# Altium schematic sheet ESP32.SchDoc
size A4; SheetNumber: 1; SheetTotal: 3
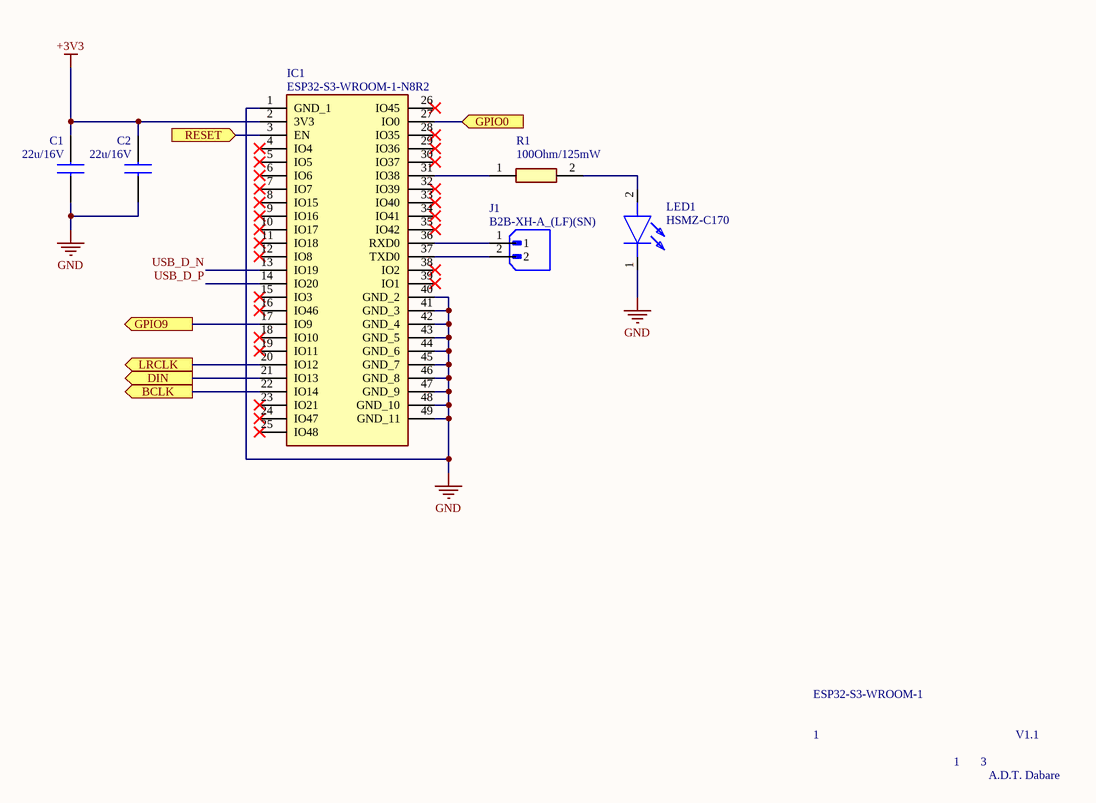
[diagram p0: ESP32.SchDoc]

## Parts
C1  22u/16V  [CAPC2012X94N]
C2  22u/16V  [C0805]
IC1  ESP32-S3-WROOM-1-N8R2  [ESP32S3WROOM1N8R2]
J1  B2B-XH-A_(LF)(SN)  [JST_B2B-XH-A_(LF)(SN)]
LED1  HSMZ-C170  [LEDC2012X90N]
R1  100Ohm/125mW  [ERA6AEB101V]

## Ports
BCLK (out, see Amplifier[2A]), DIN (out, see Amplifier[2B]), GPIO0 (in, see Peripherals[3A]), GPIO9 (out, see Peripherals[3C]), LRCLK (out, see Amplifier[2B]), RESET (in, see Peripherals[4A])

## Nets
+3V3: C1.1 C2.1 IC1.2(3V3)
GND: C1.2 C2.2 IC1.1(GND_1) IC1.40(GND_2) IC1.41(GND_3) IC1.42(GND_4) IC1.43(GND_5) IC1.44(GND_6) IC1.45(GND_7) IC1.46(GND_8) IC1.47(GND_9) IC1.48(GND_10) IC1.49(GND_11) LED1.1(K)
BCLK: IC1.22(IO14) ; port BCLK
DIN: IC1.21(IO13) ; port DIN
GPIO0: IC1.27(IO0) ; port GPIO0
GPIO9: IC1.17(IO9) ; port GPIO9
LRCLK: IC1.20(IO12) ; port LRCLK
RESET: IC1.3(EN) ; port RESET
USB_D_N: IC1.13(IO19)
USB_D_P: IC1.14(IO20)
NetIC1_31: IC1.31(IO38) R1.1
NetIC1_36: IC1.36(RXD0) J1.1
NetIC1_37: IC1.37(TXD0) J1.2
NetLED1_2: LED1.2(A) R1.2

Not connected (* = marked no-connect by the designer): IC1 4(IO4)* 5(IO5)* 6(IO6)* 7(IO7)* 8(IO15)* 9(IO16)* 10(IO17)* 11(IO18)* 12(IO8)* 15(IO3)* 16(IO46)* 18(IO10)* 19(IO11)* 23(IO21)* 24(IO47)* 25(IO48)* 26(IO45)* 28(IO35)* 29(IO36)* 30(IO37)* 32(IO39)* 33(IO40)* 34(IO41)* 35(IO42)* 38(IO2)* 39(IO1)*

## Notes on the sheet
- ESP32-S3-WROOM-1
- 1
- 3
- V1.1
- A.D.T. Dabare

## Library data of the parts
C1 = 0805YC106KAT2A: Multilayer Ceramic Capacitors MLCC - SMD/SMT KGM21AR71C106KU NEW GLOBAL PN 16V 10uF X A 581-KGM21AR71C106KU; Manufacturer_Name: Kyocera AVX; Datasheet Link: https://www.mouser.fr/datasheet/2/40/AVX_X7RDielectric_777024-1853642.pdf; Height: 0.94mm; Manufacturer_Part_Number: 0805YC106KAT2A; Mouser Part Number: 581-0805YC106KAT2A; Mouser Price/Stock: https://www.mouser.co.uk/ProductDetail/KYOCERA-AVX/0805YC106KAT2A?qs=3HJ2avRr9PKwMzeRMZhF2g%3D%3D; Arrow Part Number: 0805YC106KAT2A; Arrow Price/Stock: https://www.arrow.com/en/products/0805yc106kat2a/avx?region=nac
C2 = C0805X104K4RACAUTO: Multilayer Ceramic Capacitors MLCC - SMD/SMT 16V 0.1uF X7R 0805 10% Flex AEC-Q200; Manufacturer_Name: KEMET; Datasheet Link: https://content.kemet.com/datasheets/KEM_C1078_X7R_FT-CAP_AUTO_SMD.pdf; Height: 1.1mm; Manufacturer_Part_Number: C0805X104K4RACAUTO; Mouser Part Number: 80-C0805X104K4RAUTO; Mouser Price/Stock: https://www.mouser.co.uk/ProductDetail/KEMET/C0805X104K4RACAUTO?qs=PqoDHHvF64%2FAA39kqwjnIA%3D%3D; Arrow Part Number: C0805X104K4RACAUTO; Arrow Price/Stock: https://www.arrow.com/en/products/c0805x104k4racauto/kemet-corporation?utm_currency=USD&region=nac
IC1 = ESP32-S3-WROOM-1-N8R2: Integrated Circuit; Manufacturer_Name: Espressif Systems; Datasheet Link: https://www.mouser.com/catalog/specsheets/Espressif_ESP32_S3_WROOM_1_1U_Preliminary.pdf; Height: 3.25mm; Manufacturer_Part_Number: ESP32-S3-WROOM-1-N8R2; Mouser Part Number: 356-ESP32-S3WRM1N8R2; Mouser Price/Stock: https://www.mouser.co.uk/ProductDetail/Espressif-Systems/ESP32-S3-WROOM-1-N8R2?qs=Wj%2FVkw3K%252BMCC1Ha9x85iJA%3D%3D
J1 = B2B-XH-A_(LF)(SN): Connector Header Through Hole 2 position 0.098 (2.50mm); MF: JST Sales; MP: B2B-XH-A (LF)(SN); SnapEDA_Link: https://www.snapeda.com/parts/B2B-XH-A%20(LF)(SN)/JST+Sales+America+Inc./view-part/?ref=snap; Package: None; Value: *; Check_prices: https://www.snapeda.com/parts/B2B-XH-A%20(LF)(SN)/JST+Sales+America+Inc./view-part/?ref=eda
LED1 = HSMZ-C170: Standard LEDs - SMD AlInGaP2 Red 2 Red; Manufacturer_Name: Avago Technologies; Datasheet Link: https://docs.broadcom.com/docs/AV02-0112EN; Height: 0.9mm; Manufacturer_Part_Number: HSMZ-C170; Mouser Part Number: 630-HSMZ-C170; Mouser Price/Stock: https://www.mouser.co.uk/ProductDetail/Broadcom-Avago/HSMZ-C170?qs=YDL0qNrpDT5yNxU7mHRBEQ%3D%3D
R1 = ERA-6AED560V: Thin Film Resistors - SMD 0805 56ohms 25ppm 0.5% AEC-Q200; Manufacturer_Name: Panasonic; Datasheet Link: https://industrial.panasonic.com/cdbs/www-data/pdf/RDM0000/AOA0000C307.pdf; Height: 0.6mm; Manufacturer_Part_Number: ERA-6AED560V